# EAGLE design minimumSystem_Rizqulloh faathir akmal Y_21507334006 (EAGLE 9.6.2)
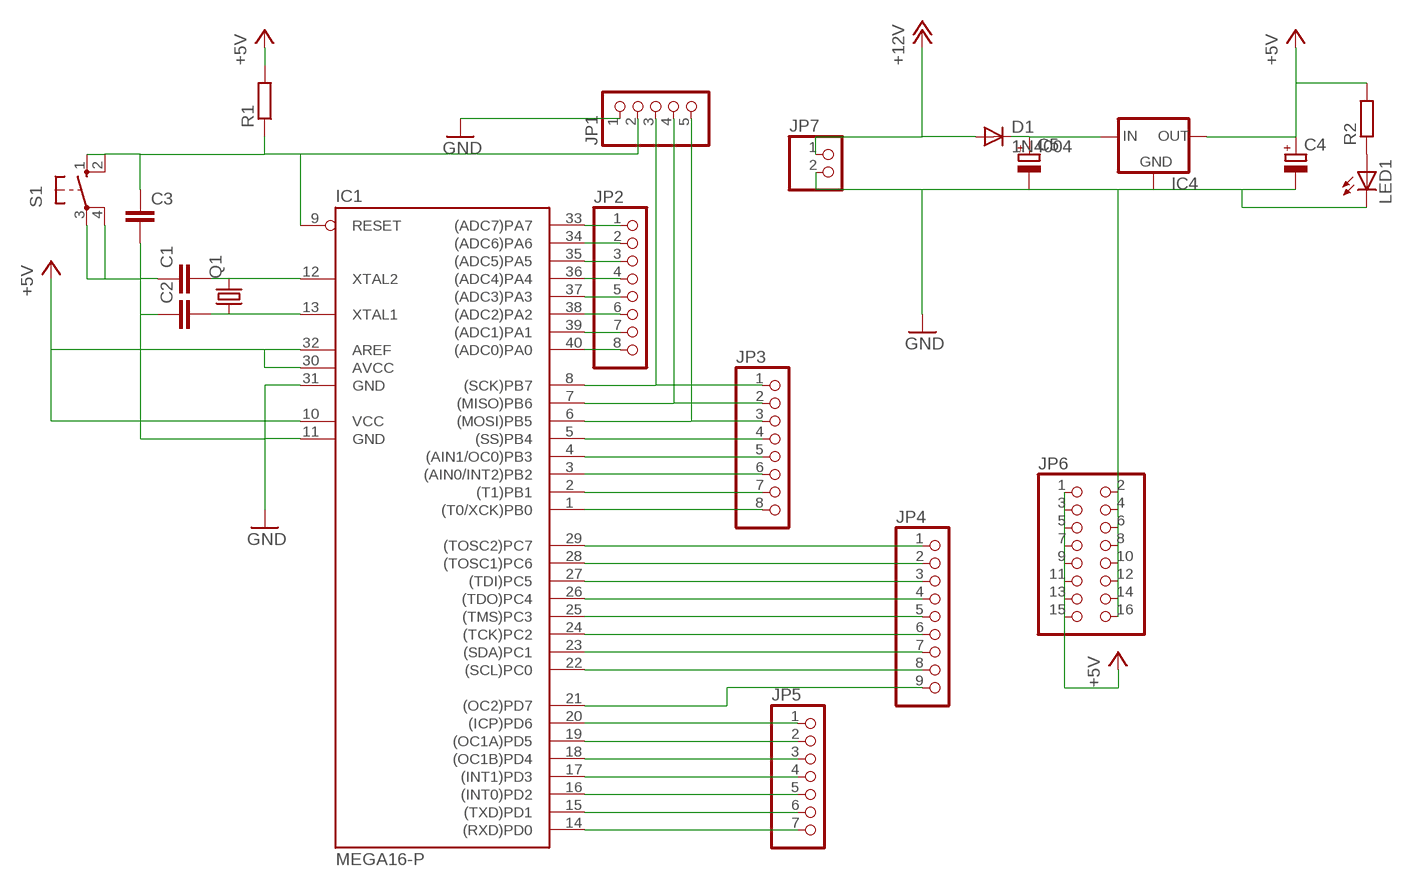
[diagram p0: schematic, sheet 1]

## Parts
C1  C-EU025-024X044  [C025-024X044]
C2  C-EU025-024X044  [C025-024X044]
C3  C-EU050-025X075  [C050-025X075]
C4  CPOL-EUE2.5-5  [E2,5-5]
C5  CPOL-EUE2.5-5  [E2,5-5]
D1  1N4004  [DO41-10]
IC1  MEGA16-P  [DIL40]
IC4  78XXS  [78XXS]
JP1  PINHD-1X5  [1X05]
JP2  PINHD-1X8  [1X08]
JP3  PINHD-1X8  [1X08]
JP4  PINHD-1X9  [1X09]
JP5  PINHD-1X7  [1X07]
JP6  PINHD-2X8  [2X08]
JP7  PINHD-1X2  [1X02]
LED1  LED5MM  [LED5MM]
Q1  CRYSTALHC49U-V  [HC49U-V]
R1  R-EU_0204/7  [0204/7]
R2  R-EU_0204/7  [0204/7]
S1  10-XX  [B3F-10XX]

## Nets
+5V: C4.+ IC1.10(VCC) IC1.30(AVCC) IC1.32(AREF) IC4.OUT JP6.1 JP6.3 JP6.5 JP6.7 JP6.9 JP6.11 JP6.13 JP6.15 R1.2 R2.2
+12V: D1.A JP7.1
C0: IC1.22((SCL)PC0) JP4.8
C1: IC1.23((SDA)PC1) JP4.7
C2: IC1.24((TCK)PC2) JP4.6
C3: IC1.25((TMS)PC3) JP4.5
D7: IC1.14((RXD)PD0) JP5.7
GND: C1.1 C2.1 C3.2 C4.- C5.- IC1.11(GND) IC1.31(GND) IC4.GND JP1.1 JP6.2 JP6.4 JP6.6 JP6.8 JP6.10 JP6.12 JP6.14 JP6.16 JP7.2 LED1.K(C) S1.3(P) S1.4(P1)
N$1: IC1.33((ADC7)PA7) JP2.1
N$2: IC1.34((ADC6)PA6) JP2.2
N$3: IC1.35((ADC5)PA5) JP2.3
N$4: IC1.36((ADC4)PA4) JP2.4
N$5: IC1.37((ADC3)PA3) JP2.5
N$6: IC1.38((ADC2)PA2) JP2.6
N$7: IC1.39((ADC1)PA1) JP2.7
N$8: IC1.40((ADC0)PA0) JP2.8
N$11: IC1.29((TOSC2)PC7) JP4.1
N$12: IC1.28((TOSC1)PC6) JP4.2
N$13: IC1.27((TDI)PC5) JP4.3
N$14: IC1.5((SS)PB4) JP3.4
N$15: IC1.20((ICP)PD6) JP5.1
N$16: IC1.19((OC1A)PD5) JP5.2
N$19: IC1.26((TDO)PC4) JP4.4
N$20: IC1.6((MOSI)PB5) JP1.5 JP3.3
N$21: IC1.4((AIN1/OC0)PB3) JP3.5
N$22: IC1.3((AIN0/INT2)PB2) JP3.6
N$23: IC1.2((T1)PB1) JP3.7
N$24: IC1.1((T0/XCK)PB0) JP3.8
N$25: C5.+ D1.C IC4.IN
N$30: IC1.15((TXD)PD1) JP5.6
N$31: IC1.16((INT0)PD2) JP5.5
N$32: IC1.17((INT1)PD3) JP5.4
N$33: C3.1 IC1.9(RESET) JP1.2 R1.1 S1.1(S) S1.2(S1)
N$34: IC1.18((OC1B)PD4) JP5.3
N$35: C1.2 IC1.12(XTAL2) Q1.2
N$36: C2.2 IC1.13(XTAL1) Q1.1
N$37: LED1.A R2.1
N$46: IC1.8((SCK)PB7) JP1.3 JP3.1
N$47: IC1.7((MISO)PB6) JP1.4 JP3.2
RS: IC1.21((OC2)PD7) JP4.9

## Library data of the parts
C1 C2 = rcl:C-EU: CAPACITOR, European symbol
C3 = resistor:C-EU: CAPACITOR, European symbol
C4 C5 = rcl:CPOL-EU: POLARIZED CAPACITOR, European symbol
D1 = diode:1N4004: DIODE general purpose rectifier, 1 A
IC1 = atmel:MEGA16-P: MICROCONTROLLER 16 Kbytes FLASH 1 kbytes SRAM 512 bytes EEPROM USART 8-channel 10 bit ADC Source: avr.lbr; MPN: ATMEGA16-16PU; OC_FARNELL: 9171142; OC_NEWARK: 01M6885
IC4 = v-reg:78XXS: VOLTAGE REGULATOR
JP1 = pinhead:PINHD-1X5: PIN HEADER
JP2 JP3 = pinhead:PINHD-1X8: PIN HEADER
JP4 = pinhead:PINHD-1X9: PIN HEADER
JP5 = pinhead:PINHD-1X7: PIN HEADER
JP6 = pinhead:PINHD-2X8: PIN HEADER
JP7 = pinhead:PINHD-1X2: PIN HEADER
LED1 = led:LED: LED OSRAM: - CHIPLED LG R971, LG N971, LY N971, LG Q971, LY Q971, LO R971, LY R971 LH N974, LH R974 LS Q976, LO Q976, LY Q976 LO Q996 - Hyper CHIPLED LW Q18S LB Q993, LB Q99A, LB R99A - SideLED LS A670, LO A670, LY A670, LG A670, LP A670 LB A673, LV A673, LT A673, LW A673 LH A674 LY A675 LS A676, LA A676, LO A676, LY A676, LW A676 LS A679, LY A679, LG A679 - Hyper Micro SIDELED® LS Y876, LA Y876, LO Y876, LY Y876 LT Y87S - SmartLED LW L88C, LW L88S LB L89C, LB L89S, LG L890 LS L89K, LO L89K, LY L89K LS L896, LA L896, LO L896, LY L896 - TOPLED LS T670, LO T670, LY T670, LG T670, LP T670 LSG T670, LSP T670, LSY T670, LOP T670, LYG T670 LG T671, LOG T671, LSG T671 LB T673, LV T673, LT T673, LW T673 LH T674 LS T676, LA T676, LO T676, LY T676, LB T676, LH T676, LSB T676, LW T676 LB T67C, LV T67C, LT T67C, LS T67K, LO T67K, LY T67K, LW E67C LS E67B, LA E67B, LO E67B, LY E67B, LB E67C, LV E67C, LT E67C LW T67C LS T679, LY T679, LG T679 LS T770, LO T770, LY T770, LG T770, LP T770 LB T773, LV T773, LT T773, LW T773 LH T774 LS E675, LA E675, LY E675, LS T675 LS T776, LA T776, LO T776, LY T776, LB T776 LHGB T686 LT T68C, LB T68C - Hyper Mini TOPLED® LB M676 - Mini TOPLED Santana® LG M470 LS M47K, LO M47K, LY M47K Source: http://www.osram.convergy.de LUXEON: - LUMILED® LXK2-PW12-R00, LXK2-PW12-S00, LXK2-PW14-U00, LXK2-PW14-V00 LXK2-PM12-R00, LXK2-PM12-S00, LXK2-PM14-U00 LXK2-PE12-Q00, LXK2-PE12-R00, LXK2-PE12-S00, LXK2-PE14-T00, LXK2-PE14-U00 LXK2-PB12-K00, LXK2-PB12-L00, LXK2-PB12-M00, LXK2-PB14-N00, LXK2-PB14-P00, LXK2-PB14-Q00 LXK2-PR12-L00, LXK2-PR12-M00, LXK2-PR14-Q00, LXK2-PR14-R00 LXK2-PD12-Q00, LXK2-PD12-R00, LXK2-PD12-S00 LXK2-PH12-R00, LXK2-PH12-S00 LXK2-PL12-P00, LXK2-PL12-Q00, LXK2-PL12-R00 Source: www.luxeon.com KINGBRIGHT: KA-3528ASYC Source: www.kingbright.com
Q1 = crystal:CRYSTAL: CRYSTAL; OC_FARNELL: 1666969; OC_NEWARK: unknown
R1 R2 = rcl:R-EU_: RESISTOR, European symbol
S1 = switch-omron:10-XX: OMRON SWITCH; MPN: B3F-1000; OC_FARNELL: 176432; OC_NEWARK: 36M3542

## Board
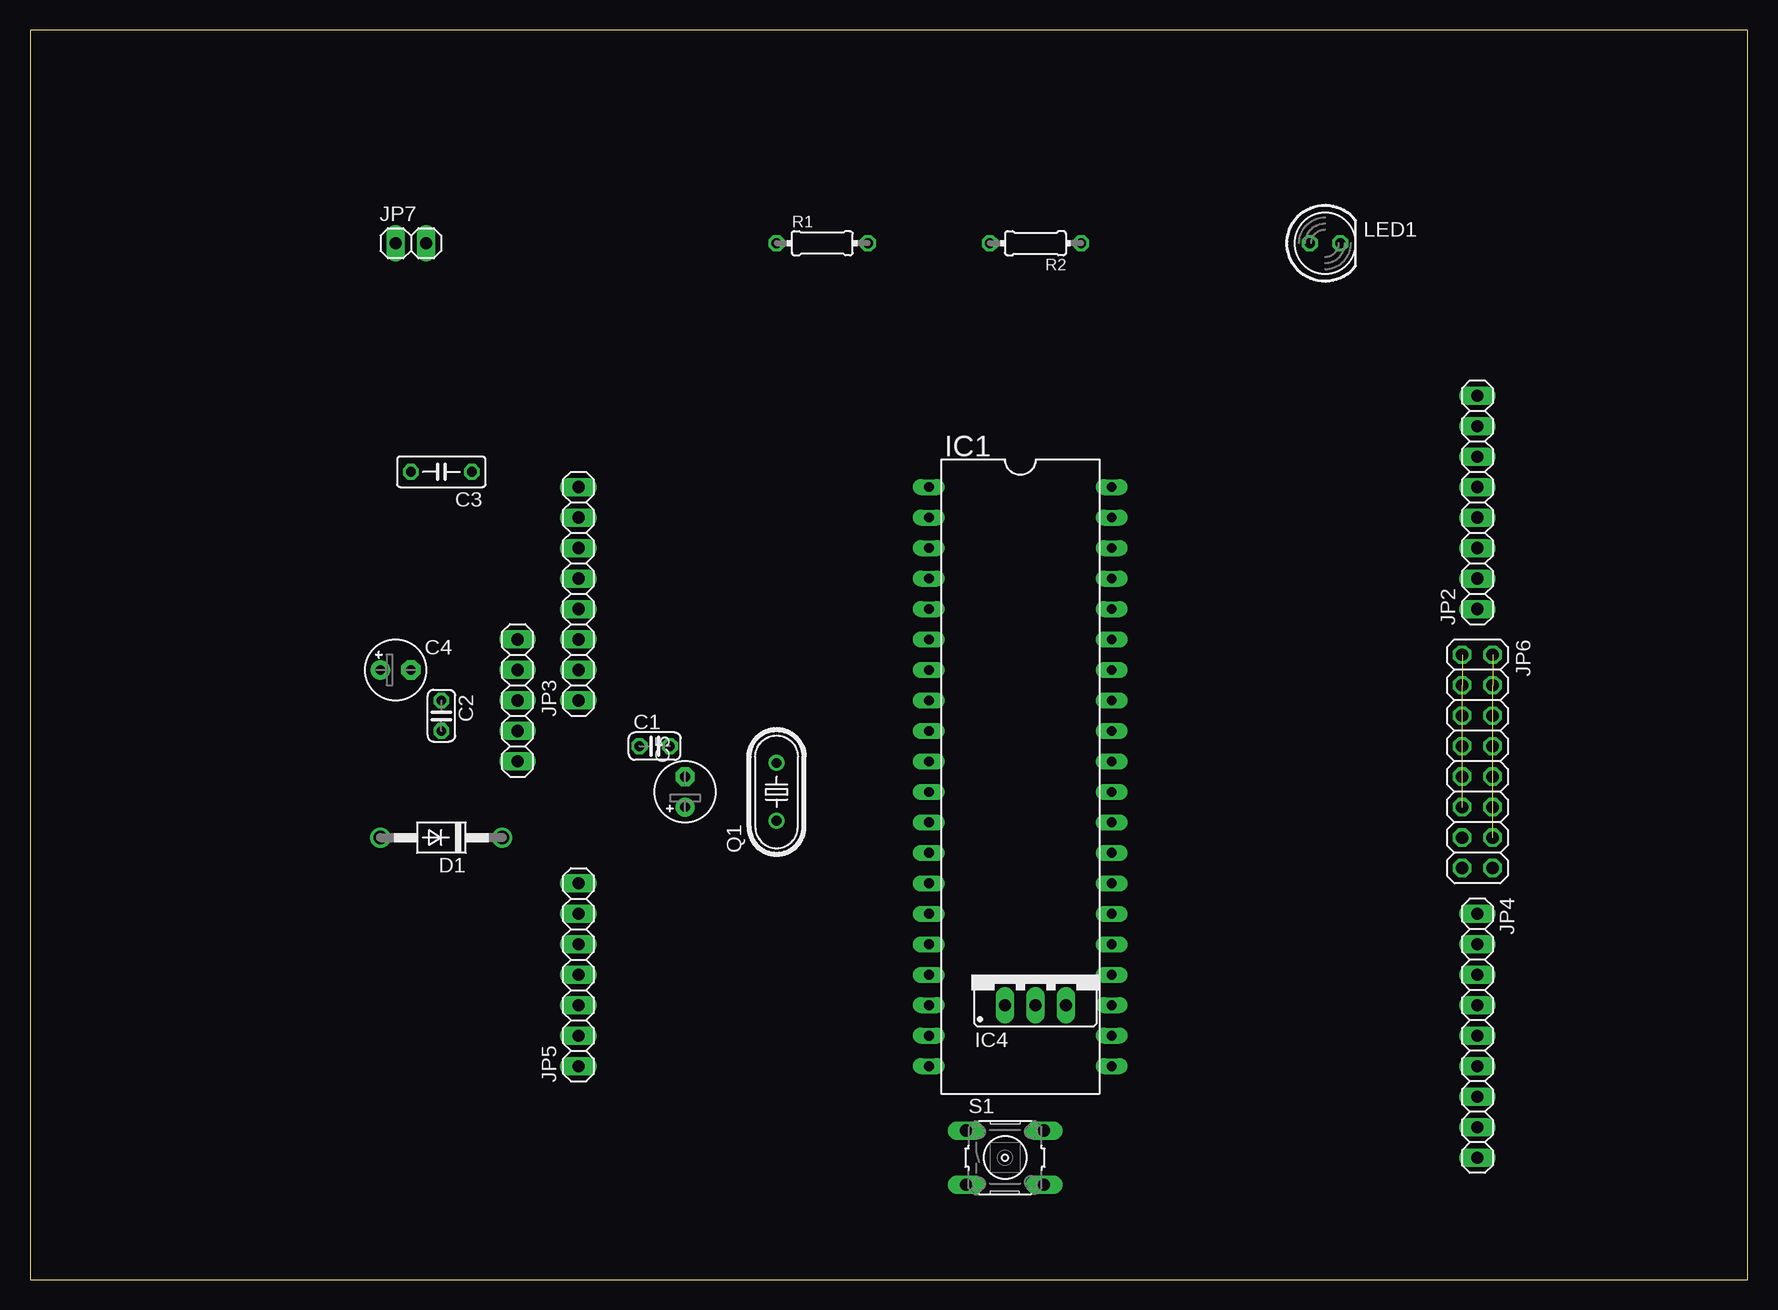
[diagram p1: board, top side]
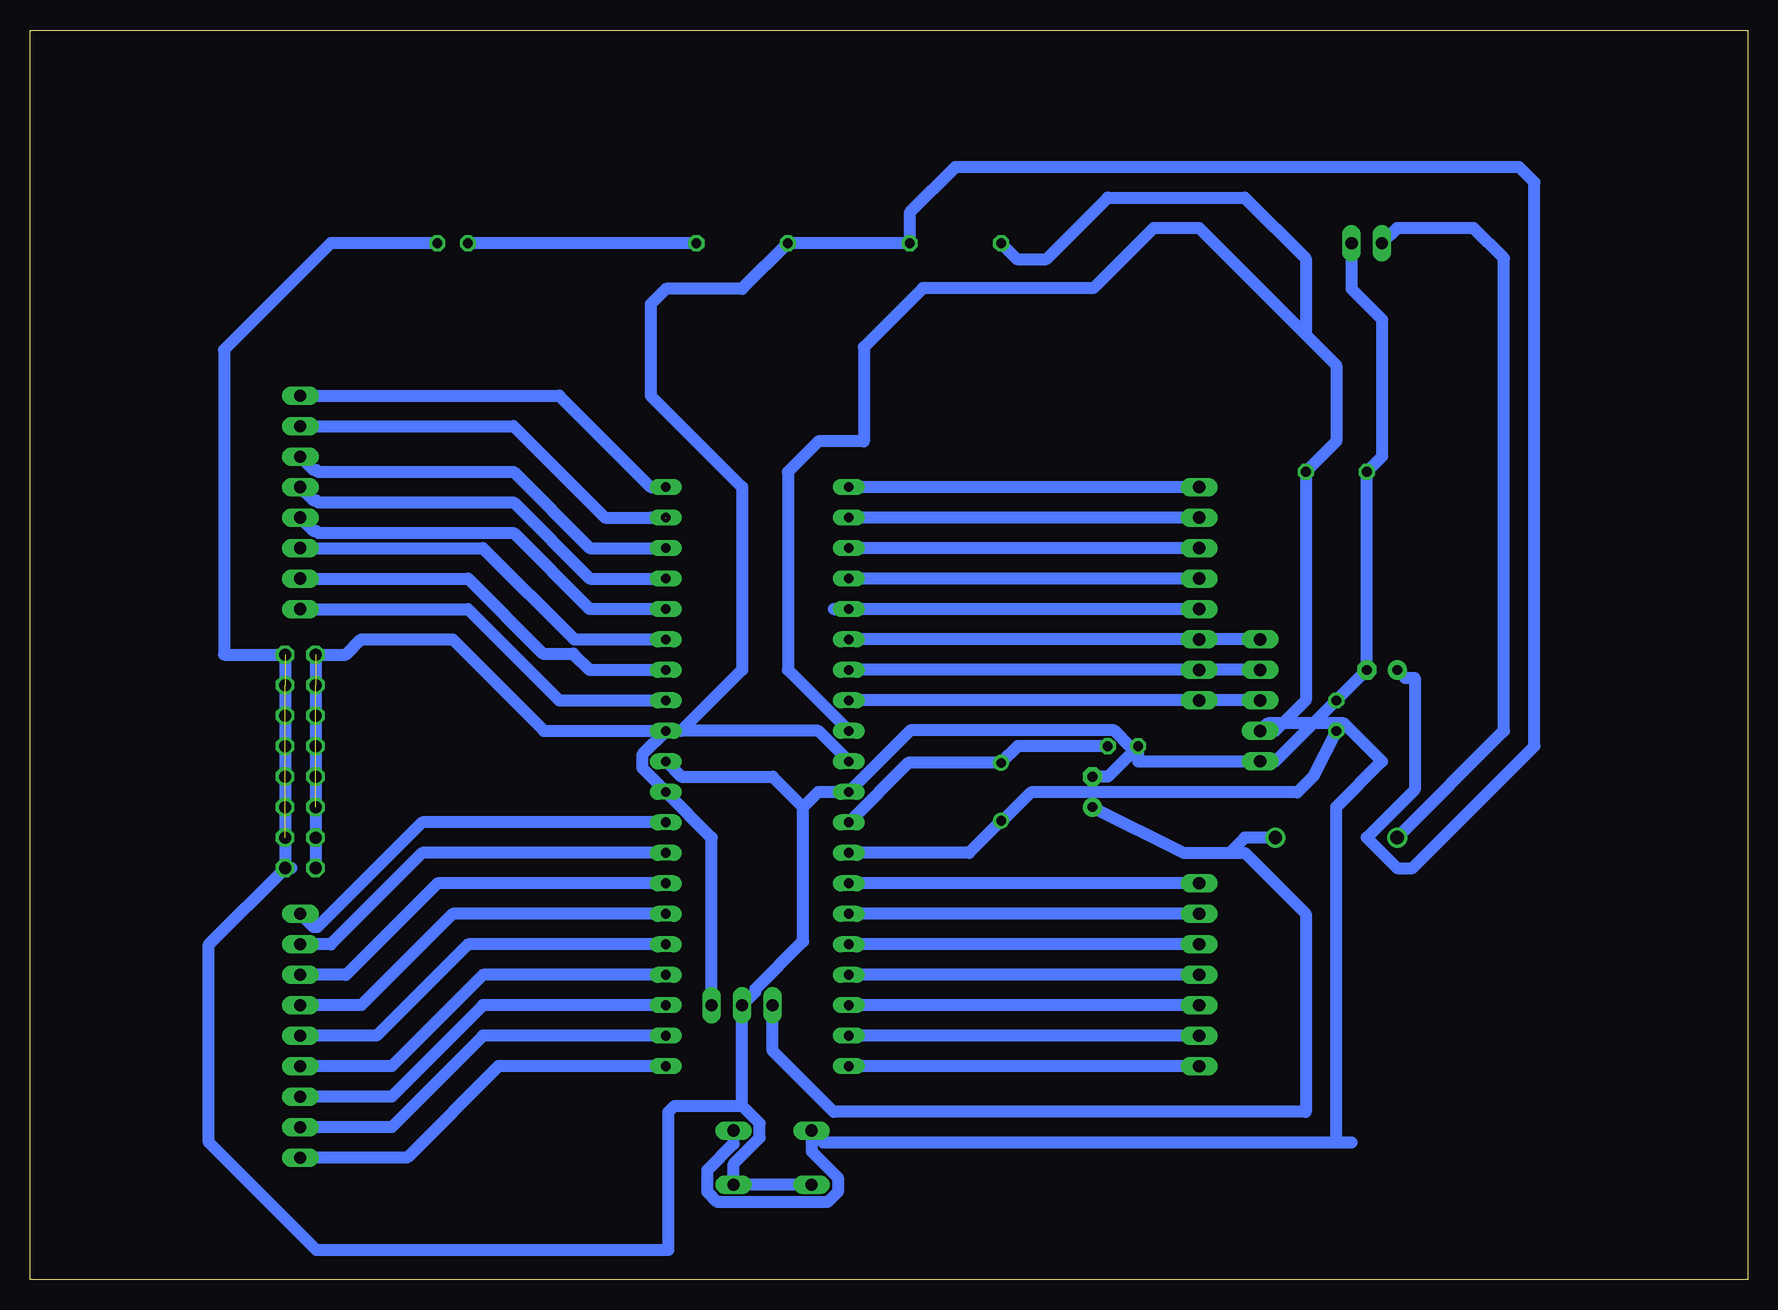
[diagram p2: board, bottom side, seen from below]

Size 143.18 x 104.13 mm. Coordinates in mm from the lower left corner, seen from the top.
Outline: 0,0 143.18,0 143.18,104.13 0,104.13 0,0
Copper layers (1*16): Top 0.035mm / dielectric 1.5mm / Bottom 0.035mm
Design rules "default": minimum track width 6mil, minimum drill 0.35mm, track to track 6mil, track to pad 6mil, pad to pad 6mil, via to via 6mil, smd to smd 6mil, copper to edge 40mil, drill to drill 6mil, minimum pad ring 10mil, minimum via ring 8mil, stop-mask expansion 4mil, vias tented up to drill 0mil, thermal gap 10mil

### Footprints (pad centres in the part's own frame; a part is rotated, then mirrored left to right if it is on the bottom)
C025-024X044 = drill 0.813 octagon: 1 -1.27,0; 2 1.27,0
C050-025X075 = drill 0.813 octagon: 1 -2.54,0; 2 2.54,0
E2,5-5 = drill 0.813 pad 1.6: + -1.27,0 | drill 0.813 pad 1.6 octagon: - 1.27,0
DO41-10 = drill 1.118: A 5.08,0; C -5.08,0
DIL40 = drill 0.813 long: 1 -24.13,-7.62; 2 -21.59,-7.62; 3 -19.05,-7.62; 4 -16.51,-7.62; 5 -13.97,-7.62; 6 -11.43,-7.62; 7 -8.89,-7.62; 8 -6.35,-7.62; 9 -3.81,-7.62; 10 -1.27,-7.62; 11 1.27,-7.62; 12 3.81,-7.62; 13 6.35,-7.62; 14 8.89,-7.62; 15 11.43,-7.62; 16 13.97,-7.62; 17 16.51,-7.62; 18 19.05,-7.62; 19 21.59,-7.62; 20 24.13,-7.62; 21 24.13,7.62; 22 21.59,7.62; 23 19.05,7.62; 24 16.51,7.62; 25 13.97,7.62; 26 11.43,7.62; 27 8.89,7.62; 28 6.35,7.62; 29 3.81,7.62; 30 1.27,7.62; 31 -1.27,7.62; 32 -3.81,7.62; 33 -6.35,7.62; 34 -8.89,7.62; 35 -11.43,7.62; 36 -13.97,7.62; 37 -16.51,7.62; 38 -19.05,7.62; 39 -21.59,7.62; 40 -24.13,7.62
78XXS = drill 1.016 long: GND 0,-2.54; IN -2.54,-2.54; OUT 2.54,-2.54
1X05 = drill 1.016 long: 1 -5.08,0; 2 -2.54,0; 3 0,0; 4 2.54,0; 5 5.08,0
1X08 = drill 1.016 long: 1 -8.89,0; 2 -6.35,0; 3 -3.81,0; 4 -1.27,0; 5 1.27,0; 6 3.81,0; 7 6.35,0; 8 8.89,0
1X09 = drill 1.016 long: 1 -10.16,0; 2 -7.62,0; 3 -5.08,0; 4 -2.54,0; 5 0,0; 6 2.54,0; 7 5.08,0; 8 7.62,0; 9 10.16,0
1X07 = drill 1.016 long: 1 -7.62,0; 2 -5.08,0; 3 -2.54,0; 4 0,0; 5 2.54,0; 6 5.08,0; 7 7.62,0
2X08 = drill 1.016 octagon: 1 -8.89,-1.27; 2 -8.89,1.27; 3 -6.35,-1.27; 4 -6.35,1.27; 5 -3.81,-1.27; 6 -3.81,1.27; 7 -1.27,-1.27; 8 -1.27,1.27; 9 1.27,-1.27; 10 1.27,1.27; 11 3.81,-1.27; 12 3.81,1.27; 13 6.35,-1.27; 14 6.35,1.27; 15 8.89,-1.27; 16 8.89,1.27
1X02 = drill 1.016 long: 1 -1.27,0; 2 1.27,0
LED5MM = drill 0.813 octagon: A -1.27,0; K 1.27,0
HC49U-V = drill 0.813: 1 -2.413,0; 2 2.413,0
0204/7 = drill 0.813 octagon: 1 -3.81,0; 2 3.81,0
B3F-10XX = drill 1.016 long: 1 -3.251,2.261; 2 3.251,2.261; 3 -3.251,-2.261; 4 3.251,-2.261

### Placement (x,y rotation side)
C1  52.07,44.45 0 top
C2  34.29,46.99 270 top
C3  34.29,67.31 180 top
C4  30.48,50.8 0 top
C5  54.61,40.64 90 top
D1  34.29,36.83 180 top
IC1  82.55,41.91 270 top
IC4  83.82,25.4 0 top
JP1  40.64,48.26 90 top
JP2  120.65,64.77 90 top
JP3  45.72,57.15 90 top
JP4  120.65,20.32 270 top
JP5  45.72,25.4 90 top
JP6  120.65,43.18 270 top
JP7  31.75,86.36 0 top
LED1  107.95,86.36 0 top
Q1  62.23,40.64 90 top
R1  66.04,86.36 0 top
R2  83.82,86.36 180 top
S1  81.28,10.16 0 top

### Tracks (layer width: path | path; a pad name or v marks a point on that pad's centre or on a via)
+5V  (5 unrouted)
  Bottom 1.016: IC1.32 100.33,45.72 107.95,53.34 115.57,53.34 116.84,52.07 JP6.1 JP6.13 JP6.15 | IC4.OUT 86.36,36.83 IC1.30 90.17,40.65 92.15,42.63 92.15,43.73 90.17,45.71 IC1.32 | IC1.10 77.47,45.72 IC1.32 | IC1.32 88.9,45.72 83.82,50.8 83.82,66.04 91.44,73.66 91.44,81.28 90.17,82.55 83.82,82.55 R2.2 R1.2 69.85,88.9 66.04,92.71 19.05,92.71 17.78,91.44 17.78,44.45 27.94,34.29 29.21,34.29 31.75,36.83 27.75,40.83 27.75,50.14 28.55,50.14 C4.+
+12V
  Bottom 1.016: D1.A 20.32,45.72 20.32,85.09 22.86,87.63 29.21,87.63 JP7.1
C0
  Bottom 1.016: IC1.22 105.41,20.32 113.03,12.7 JP4.8
C1
  Bottom 1.016: JP4.7 113.03,15.24 105.41,22.86 IC1.23
C2
  Bottom 1.016: IC1.24 105.41,25.4 113.03,17.78 JP4.6
C3
  Bottom 1.016: IC1.25 106.68,27.94 114.3,20.32 JP4.5
D7
  Bottom 1.016: JP5.7 IC1.14
GND  (6 unrouted)
  Bottom 1.016: JP6.16 JP6.2 127,52.07 127,77.47 118.11,86.36 LED1.K | 90.17,43.17 IC1.31 88.9,41.91 81.28,41.91 78.74,39.37 | 121.39,34.29 JP6.16 | JP6.16 128.27,27.94 128.27,11.43 119.31,2.47 89.96,2.47 89.96,13.97 89.45,14.48 83.82,14.48 | 78.74,39.37 78.74,28.17 82.7,24.21 82.7,23.98 IC4.GND 83.82,14.48 | 78.74,39.37 77.47,40.64 IC1.11 69.8,45.77 52.79,45.77 51.47,44.45 C1.1 | JP7.2 33.02,82.55 30.48,80.01 30.48,68.58 C3.2 C4.- C2.1 39.37,43.18 JP1.1 50.8,43.18 C1.1 | S1.3 83.54,7.9 83.82,7.62 84.25,7.62 S1.4 84.53,9.65 82.35,11.83 82.35,13.01 83.82,14.48 | C1.1 53.34,41.91 C5.-
N$1
  Bottom 1.016: JP2.1 106.68,55.88 99.06,48.26 IC1.33
N$2
  Bottom 1.016: IC1.34 96.52,50.8 97.89,52.17 100.43,52.17 106.68,58.42 JP2.2
N$3
  Bottom 1.016: IC1.35 97.79,53.34 105.41,60.96 JP2.3
N$4
  Bottom 1.016: JP2.4 119.53,62.38 119.3,62.38 119.15,62.23 102.87,62.23 96.52,55.88 IC1.36
N$5
  Bottom 1.016: JP2.5 119.53,64.92 119.3,64.92 119.15,64.77 102.87,64.77 96.52,58.42 IC1.37
N$6
  Bottom 1.016: JP2.6 119.53,67.46 119.3,67.46 119.15,67.31 102.87,67.31 96.52,60.96 IC1.38
N$7  (1 unrouted)
  Bottom 1.016: JP2.7 102.87,71.12 100.33,68.58 95.25,63.5 91.44,63.5 90.18,63.5
N$8
  Bottom 1.016: JP2.8 99.06,73.66 91.44,66.04 IC1.40
N$11
  Bottom 1.016: IC1.29 110.49,38.1 119.23,29.36 119.53,29.36 JP4.1
N$12
  Bottom 1.016: JP4.2 118.11,27.94 110.49,35.56 IC1.28
N$13
  Bottom 1.016: IC1.27 109.22,33.02 116.84,25.4 JP4.3
N$14
  Bottom 1.016: JP3.4 IC1.5 76.2,55.88
N$15
  Bottom 1.016: JP5.1 IC1.20
N$16
  Bottom 1.016: JP5.2 IC1.19
N$19
  Bottom 1.016: IC1.26 107.95,30.48 115.57,22.86 JP4.4
N$20
  Bottom 1.016: IC1.6 JP3.3 JP1.5
N$21
  Bottom 1.016: JP3.5 IC1.4
N$22
  Bottom 1.016: JP3.6 IC1.3
N$23
  Bottom 1.016: JP3.7 IC1.2
N$24
  Bottom 1.016: JP3.8 IC1.1
N$25
  Bottom 1.016: C5.+ 46.99,35.56 43.18,35.56 | 43.18,35.56 41.91,35.56 36.83,30.48 36.83,13.97 76.2,13.97 81.28,19.05 IC4.IN | D1.C 41.91,36.83 43.18,35.56
N$30
  Bottom 1.016: JP5.6 IC1.15
N$31
  Bottom 1.016: JP5.5 IC1.16
N$32
  Bottom 1.016: JP5.4 IC1.17
N$33
  Bottom 1.016: 36.83,78.74 45.72,87.63 49.53,87.63 54.55,82.61 68.75,82.61 73.66,77.71 73.66,69.85 77.47,69.85 80.01,67.31 80.01,50.8 IC1.9 | 36.83,78.74 34.29,76.2 34.29,69.85 C3.1 36.83,48.26 39.37,45.72 JP1.2 40.01,46.36 33.66,46.36 30.48,43.18 34.29,39.37 34.29,11.43 | S1.2 84.53,11.3 86.72,9.12 86.72,7.31 85.86,6.45 76.7,6.45 75.84,7.31 75.84,8.49 78.03,10.67 S1.1 77.04,11.43 34.29,11.43 | 36.83,78.74 36.83,85.09 41.91,90.17 53.34,90.17 58.47,85.04 60.91,85.04 R1.1 | 34.29,11.43 33.02,11.43
N$34
  Bottom 1.016: JP5.3 IC1.18
N$35
  Bottom 1.016: C1.2 60.83,44.45 Q1.2 69.98,43.05 IC1.12
N$36
  Bottom 1.016: C2.2 36.23,41.91 37.55,40.59 59.74,40.59 62.23,38.1 Q1.1 64.9,35.56 IC1.13
N$37
  Bottom 1.016: R2.1 LED1.A
N$46
  Bottom 1.016: IC1.8 JP3.1 JP1.3
N$47
  Bottom 1.016: IC1.7 JP3.2 JP1.4
RS
  Bottom 1.016: IC1.21 104.14,17.78 111.76,10.16 JP4.9